# Altium schematic sheet MCU.SchDoc
size A4; SheetNumber: 2; SheetTotal: 8; SPICEModelCacheNGFSRWWY: <root> / <DocumentId>NGFSRWWY</DocumentId> / <CacheFrame Number="0"> / <Model Name="led0" Kind="MDL"> / <Text>*Typ INFRARED GaAs LED: Vf=1.2V Vr=5V If=40mA trr=3uS / *LED Pinout: 1=A, 2=K / .MODEL LED0 D (IS=93.5P RS=84M N=2.63 BV=5 IBV=10U / + CJO=2.97P VJ=.75 M=.333 TT=4.32U)</Text> / </Model> / <Model Name="dpsw2" Kind="CKT"> / <Text>* DIP switch 2 / * jjt 19/6/2002: created / * / *             Switch connections: / *             sw1 / *             |  |  sw2 / *             |  |  |  | / *             |  |  |  | / .subckt dpsw2 1  2  4  5 / + PARAMS: STATE1=0 STATE2=0 RON=1m ROFF=100E6 / * / V1 3 0 {STATE1} / V2 6 0 {STATE2} / * / SDIP1 1 2 3 0 DIPMOD / SDIP2 4 5 6 0 DIPMOD / * / .MODEL DIPMOD SW(VT=0.5 RON={RON} ROFF={ROFF}) / .ends dpsw2</Text> / </Model> / </CacheFrame> / </root>
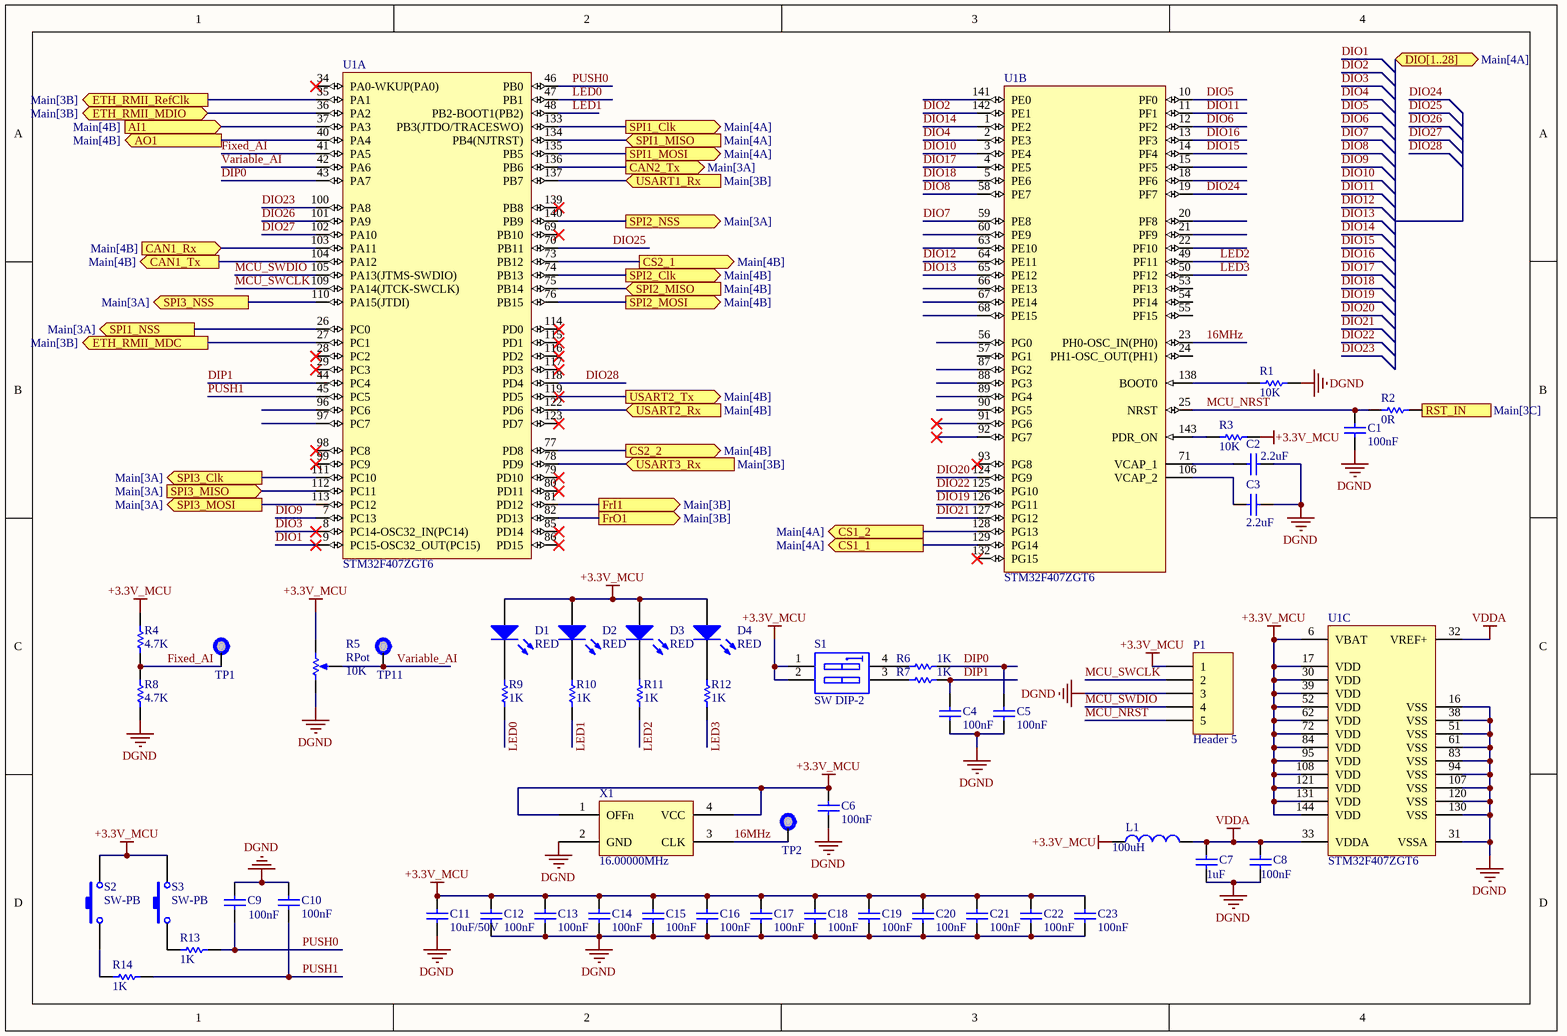
[diagram p0: MCU.SchDoc]

## Parts
C1  100nF  [0603c]
C2  2.2uF  [0805C]
C3  2.2uF  [0805C]
C4  100nF  [0603c]
C5  100nF  [0603c]
C6  100nF  [0603C]
C7  1uF  [0805C]
C8  100nF  [0603C]
C9  100nF  [0603c]
C10  100nF  [0603c]
C11  value 10uF/50V  [1206C]  (hidden comment: CGA5L1X7R1H106K160AC)
C12  value 100nF  [0603C]  (hidden comment: CGA3E2X7R1H104K080AA)
C13  value 100nF  [0603C]  (hidden comment: CGA3E2X7R1H104K080AA)
C14  value 100nF  [0603C]  (hidden comment: CGA3E2X7R1H104K080AA)
C15  value 100nF  [0603C]  (hidden comment: CGA3E2X7R1H104K080AA)
C16  value 100nF  [0603C]  (hidden comment: CGA3E2X7R1H104K080AA)
C17  value 100nF  [0603C]  (hidden comment: CGA3E2X7R1H104K080AA)
C18  value 100nF  [0603C]  (hidden comment: CGA3E2X7R1H104K080AA)
C19  value 100nF  [0603C]  (hidden comment: CGA3E2X7R1H104K080AA)
C20  value 100nF  [0603C]  (hidden comment: CGA3E2X7R1H104K080AA)
C21  value 100nF  [0603C]  (hidden comment: CGA3E2X7R1H104K080AA)
C22  value 100nF  [0603C]  (hidden comment: CGA3E2X7R1H104K080AA)
C23  value 100nF  [0603C]  (hidden comment: CGA3E2X7R1H104K080AA)
D1  RED  [0805LED]
D2  RED  [0805LED]
D3  RED  [0805LED]
D4  RED  [0805LED]
L1  100uH  [0805FB]
P1  Header 5  [HDR1X5]
R1  value 10K  [0805]  (hidden comment: Res1)
R2  value 0R  [0805]  (hidden comment: Res1)
R3  value 10K  [0805]  (hidden comment: Res1)
R4  value 4.7K  [0805]  (hidden comment: Res1)
R5  RPot  value 10K  [POT-MULTITURN]
R6  value 1K  [0805]  (hidden comment: Res1)
R7  value 1K  [0805]  (hidden comment: Res1)
R8  value 4.7K  [0805]  (hidden comment: Res1)
R9  value 1K  [0805]  (hidden comment: Res1)
R10  value 1K  [0805]  (hidden comment: Res1)
R11  value 1K  [0805]  (hidden comment: Res1)
R12  value 1K  [0805]  (hidden comment: Res1)
R13  value 1K  [0805]  (hidden comment: Res1)
R14  value 1K  [0805]  (hidden comment: Res1)
S1  SW DIP-2  [DIP-4]
S2  SW-PB  [PUSHBUTTON-SMD]
S3  SW-PB  [PUSHBUTTON-SMD]
TP1  TestPoint  [TP]  (value not drawn)
TP2  TestPoint  [TP]  (value not drawn)
TP11  TestPoint  [TP]  (value not drawn)
U1  STM32F407ZGT6  [STM-LQFP144_N]  (parts A,B,C of 3)
X1  value 16.00000MHz  [OSC-SMT]  (hidden comment: SG-8018CB 16.000000 MHZ TJHPA)

## Ports
AI1 (in, see Main[4B]), AO1 (out, see Main[4B]), CAN1_Rx (in, see Main[4B]), CAN1_Tx (out, see Main[4B]), CAN2_Tx (out, see Main[3A]), CS1_1 (out, see Main[4A]), CS1_2 (out, see Main[4A]), CS2_1 (out, see Main[4B]), CS2_2 (out, see Main[4B]), DIO[1..28] (bidir, see Main[4A]), ETH_RMII_MDC (out, see Main[3B]), ETH_RMII_MDIO (bidir, see Main[3B]), ETH_RMII_RefClk (out, see Main[3B]), FrI1 (out, see Main[3B]), FrO1 (out, see Main[3B]), RST_IN (in, see Main[3C]), SPI1_Clk (out, see Main[4A]), SPI1_MISO (in, see Main[4A]), SPI1_MOSI (out, see Main[4A]), SPI1_NSS (out, see Main[3A]), SPI2_Clk (out, see Main[4B]), SPI2_MISO (in, see Main[4B]), SPI2_MOSI (out, see Main[4B]), SPI2_NSS (out, see Main[3A]), SPI3_Clk (out, see Main[3A]), SPI3_MISO (in, see Main[3A]), SPI3_MOSI (out, see Main[3A]), SPI3_NSS (out, see Main[3A]), USART1_Rx (in, see Main[3B]), USART2_Rx (in, see Main[4B]), USART2_Tx (out, see Main[4B]), USART3_Rx (in, see Main[3B])

## Nets
+3.3V_MCU: C6.1 C11.2 C12.1 C13.1 C14.1 C15.1 C16.1 C17.1 C18.1 C19.1 C20.1 C21.1 C22.1 C23.1 D1.1(A) D2.1(A) D3.1(A) D4.1(A) L1.1 P1.1 R3.1 R4.2 R5.3(BOT) S1.1(A1) S1.2(A2) S2.2 S3.2 U1.6(VBAT) U1.17(VDD) U1.30(VDD) U1.39(VDD) U1.52(VDD) U1.62(VDD) U1.72(VDD) U1.84(VDD) U1.95(VDD) U1.108(VDD) U1.121(VDD) U1.131(VDD) U1.144(VDD) X1.1(OFFn) X1.4(VCC)
DGND: C1.2 C2.2 C3.2 C4.2 C5.2 C6.2 C7.1 C8.1 C9.1 C10.1 C11.1 C12.2 C13.2 C14.2 C15.2 C16.2 C17.2 C18.2 C19.2 C20.2 C21.2 C22.2 C23.2 P1.3 R1.1 R5.1(TOP) R8.1 U1.16(VSS) U1.31(VSSA) U1.38(VSS) U1.51(VSS) U1.61(VSS) U1.83(VSS) U1.94(VSS) U1.107(VSS) U1.120(VSS) U1.130(VSS) X1.2(GND)
VDDA: C7.2 C8.2 L1.2 U1.32(VREF+) U1.33(VDDA)
16MHz: TP2.1 U1.23(PH0-OSC_IN(PH0)) X1.3(CLK)
AI1: U1.37(PA3) ; port AI1
AO1: U1.40(PA4) ; port AO1
CAN1_Rx: U1.103(PA11) ; port CAN1_Rx
CAN1_Tx: U1.104(PA12) ; port CAN1_Tx
CAN2_Tx: U1.136(PB6) ; port CAN2_Tx
CS1_1: U1.129(PG14) ; port CS1_1
CS1_2: U1.128(PG13) ; port CS1_2
CS2_1: U1.73(PB12) ; port CS2_1
CS2_2: U1.77(PD8) ; port CS2_2
DIO1: U1.9(PC15-OSC32_OUT(PC15))
DIO2: U1.142(PE1)
DIO3: U1.8(PC14-OSC32_IN(PC14))
DIO4: U1.2(PE3)
DIO5: U1.10(PF0)
DIO6: U1.12(PF2)
DIO7: U1.59(PE8)
DIO8: U1.58(PE7)
DIO9: U1.7(PC13)
DIO10: U1.3(PE4)
DIO11: U1.11(PF1)
DIO12: U1.64(PE11)
DIO13: U1.65(PE12)
DIO14: U1.1(PE2)
DIO15: U1.14(PF4)
DIO16: U1.13(PF3)
DIO17: U1.4(PE5)
DIO18: U1.5(PE6)
DIO19: U1.126(PG11)
DIO20: U1.124(PG9)
DIO21: U1.127(PG12)
DIO22: U1.125(PG10)
DIO23: U1.100(PA8)
DIO24: U1.19(PF7)
DIO25: U1.70(PB11)
DIO26: U1.101(PA9)
DIO27: U1.102(PA10)
DIO28: U1.118(PD4)
DIP0: C5.1 R6.2 U1.43(PA7)
DIP1: C4.1 R7.2 U1.44(PC4)
ETH_RMII_MDC: U1.27(PC1) ; port ETH_RMII_MDC
ETH_RMII_MDIO: U1.36(PA2) ; port ETH_RMII_MDIO
ETH_RMII_RefClk: U1.35(PA1) ; port ETH_RMII_RefClk
Fixed_AI: R4.1 R8.2 TP1.1 U1.41(PA5)
FrI1: U1.81(PD12) ; port FrI1
FrO1: U1.82(PD13) ; port FrO1
LED0: R9.1 U1.47(PB1)
LED1: R10.1 U1.48(PB2-BOOT1(PB2))
LED2: R11.1 U1.49(PF11)
LED3: R12.1 U1.50(PF12)
MCU_NRST: C1.1 P1.5 R2.2 U1.25(NRST)
MCU_SWCLK: P1.2 U1.109(PA14(JTCK-SWCLK))
MCU_SWDIO: P1.4 U1.105(PA13(JTMS-SWDIO))
PUSH0: C9.2 R13.2 U1.46(PB0)
PUSH1: C10.2 R14.1 U1.45(PC5)
RST_IN: R2.1 ; port RST_IN
SPI1_Clk: U1.133(PB3(JTDO/TRACESWO)) ; port SPI1_Clk
SPI1_MISO: U1.134(PB4(NJTRST)) ; port SPI1_MISO
SPI1_MOSI: U1.135(PB5) ; port SPI1_MOSI
SPI1_NSS: U1.26(PC0) ; port SPI1_NSS
SPI2_Clk: U1.74(PB13) ; port SPI2_Clk
SPI2_MISO: U1.75(PB14) ; port SPI2_MISO
SPI2_MOSI: U1.76(PB15) ; port SPI2_MOSI
SPI2_NSS: U1.140(PB9) ; port SPI2_NSS
SPI3_Clk: U1.111(PC10) ; port SPI3_Clk
SPI3_MISO: U1.112(PC11) ; port SPI3_MISO
SPI3_MOSI: U1.113(PC12) ; port SPI3_MOSI
SPI3_NSS: U1.110(PA15(JTDI)) ; port SPI3_NSS
USART1_Rx: U1.137(PB7) ; port USART1_Rx
USART2_Rx: U1.122(PD6) ; port USART2_Rx
USART2_Tx: U1.119(PD5) ; port USART2_Tx
USART3_Rx: U1.78(PD9) ; port USART3_Rx
Variable_AI: R5.2(TAP) TP11.1 U1.42(PA6)
NetC2_1: C2.1 U1.71(VCAP_1)
NetC3_1: C3.1 U1.106(VCAP_2)
NetD1_2: D1.2(K) R9.2
NetD2_2: D2.2(K) R10.2
NetD3_2: D3.2(K) R11.2
NetD4_2: D4.2(K) R12.2
NetR1_2: R1.2 U1.138(BOOT0)
NetR3_2: R3.2 U1.143(PDR_ON)
NetR6_1: R6.1 S1.4(B1)
NetR7_1: R7.1 S1.3(B2)
NetR13_1: R13.1 S3.1
NetR14_2: R14.2 S2.1

Not connected (* = marked no-connect by the designer): U1 15(PF5) 18(PF6) 20(PF8) 21(PF9) 22(PF10) 24(PH1-OSC_OUT(PH1)) 28(PC2)* 29(PC3)* 34(PA0-WKUP(PA0))* 53(PF13) 54(PF14) 55(PF15) 56(PG0) 57(PG1) 60(PE9) 63(PE10) 66(PE13) 67(PE14) 68(PE15) 69(PB10)* 79(PD10)* 80(PD11)* 85(PD14)* 86(PD15)* 87(PG2) 88(PG3) 89(PG4) 90(PG5) 91(PG6)* 92(PG7)* 93(PG8)* 96(PC6) 97(PC7) 98(PC8)* 99(PC9)* 114(PD0)* 115(PD1)* 116(PD2)* 117(PD3)* 123(PD7)* 132(PG15)* 139(PB8)* 141(PE0)

## Library data of the parts
C1-C10 = Cap: LOW ESR; Published: 8-Jun-2000; LatestRevisionDate: 17-Jul-2002; LatestRevisionNote: Re-released for DXP Platform.; PackageReference: RAD-0.3; Publisher: Altium Limited; PackageDescription: Radial Cap, Thru-Hole; 2 Leads; 0.3 in Pin Spacing
  C1 C4-C6 C8-C10: Value: 100nF
  C2 C3: Value: 2.2uF
  C7: Value: 1uF
C11-C23 = Cap: Capacitor; Published: 8-Jun-2000; LatestRevisionDate: 17-Jul-2002; LatestRevisionNote: Re-released for DXP Platform.; PackageReference: RAD-0.3; Publisher: Altium Limited; PackageDescription: Radial Cap, Thru-Hole; 2 Leads; 0.3 in Pin Spacing
D1-D4 = LED0: Typical INFRARED GaAs LED; Published: 8-Jun-2000; LatestRevisionDate: 08-Jul-2005; LatestRevisionNote: Mech Layer 1 removed.; PackageReference: LED-0; Publisher: Altium Limited; PackageDescription: LED; 2 Leads
L1 = Inductor: Code_IEC: 1005; Value: BEAD(FCM1608KF-601T03); Published: 8-Jun-2000; LatestRevisionDate: 29-May-2009; LatestRevisionNote: IPC-7351 Footprint Added.; PackageReference: 0402-A; Publisher: Altium Limited; PackageDescription: Chip Inductor; Code_JEITA: 0402
P1 = Header 5: Header, 5-Pin; LatestRevisionDate: 17-Jul-2002; LatestRevisionNote: Re-released for DXP Platform.; Publisher: Altium Limited
R1-R4 R6-R14 = Res1: Resistor; Published: 8-Jun-2000; LatestRevisionDate: 17-Jul-2002; LatestRevisionNote: Re-released for DXP Platform.; PackageReference: AXIAL-0.3; Publisher: Altium Limited; PackageDescription: Axial Device, Thru-Hole; 2 Leads; 0.3 in Pin Spacing
R5 = RPot: Potentiometer; Sim Note: Enter the Resistance value and the set point into parameter fields.; Set Position: 0.5; Published: 8-Jun-2000; LatestRevisionDate: 17-Jul-2002; LatestRevisionNote: Re-released for DXP Platform.; PackageReference: VR5; Publisher: Altium Limited; PackageDescription: Variable Resistor, Thru-Hole; 3 Leads
S1 = SW DIP-2: DIP Switch, 2 Position, SPST; Published: 24-Mar-1999; LatestRevisionDate: 17-Jul-2002; LatestRevisionNote: Re-released for DXP Platform.; PackageReference: DIP-4; Publisher: Altium Limited
S2 S3 = SW-PB: Switch; Published: 24-Mar-1999; LatestRevisionDate: 17-Jul-2002; LatestRevisionNote: Re-released for DXP Platform.; PackageReference: SPST-2; Publisher: Altium Limited; PackageDescription: Switch; 2 Leads
U1 = STM32F407ZGT6: ARM Cortex-M4 32-bit MCU+FPU, 210 DMIPS, 1024 kB Flash, 192 kB Internal RAM, 114 I/Os, 144-pin LQFP, -40 to 85 degC, Tray; Manufacturer: STMicroelectronics; D/A Converter: 2x12-bit; FLASH Size (Prog) (kB): 1024; I/Os (High Current): 114; Internal RAM Size (kB): 192; Operating Frequency(F) (Processor speed) (MHz): 168; Supply Voltage(Vcc) max (V): 3.6; Supply Voltage(Vcc) min (V): 1.8; DatasheetVersion: Rev. 4; PackageVersion: Rev. 4, 06/2013; PackageReference: LQFP144; PackageDescription: 144-Pin Low Profile Quad Flat Package, 20 x 20 mm Body, 0.5 mm Pitch; Supplier 1: Digi-Key; Supplier Part Number 1: 497-11766-ND; Supplier 2: Newark; Supplier Part Number 2: 73T2334; Supplier 3: Mouser; Supplier Part Number 3: 511-STM32F407ZGT6; Core: ARM Cortex-M4; Packing: Tray; Mounting Technology: Surface Mount; PartNumber: STM32F407ZGT6; ComponentLink1Description: Manufacturer URL; ComponentLink1URL: http://www.st.com/web/en/home.html; ComponentLink2Description: Datasheet; ComponentLink2URL: http://www.st.com/st-web-ui/static/active/en/resource/technical/document/datasheet/DM00037051.pdf; ComponentLink3Description: Package Specification; ComponentLink3URL: http://www.st.com/st-web-ui/static/active/en/resource/technical/document/datasheet/DM00037051.pdf
X1 = Oscillator